# EAGLE schematic reaction_wheel_board_2017_12_11 (EAGLE 8.5.0)
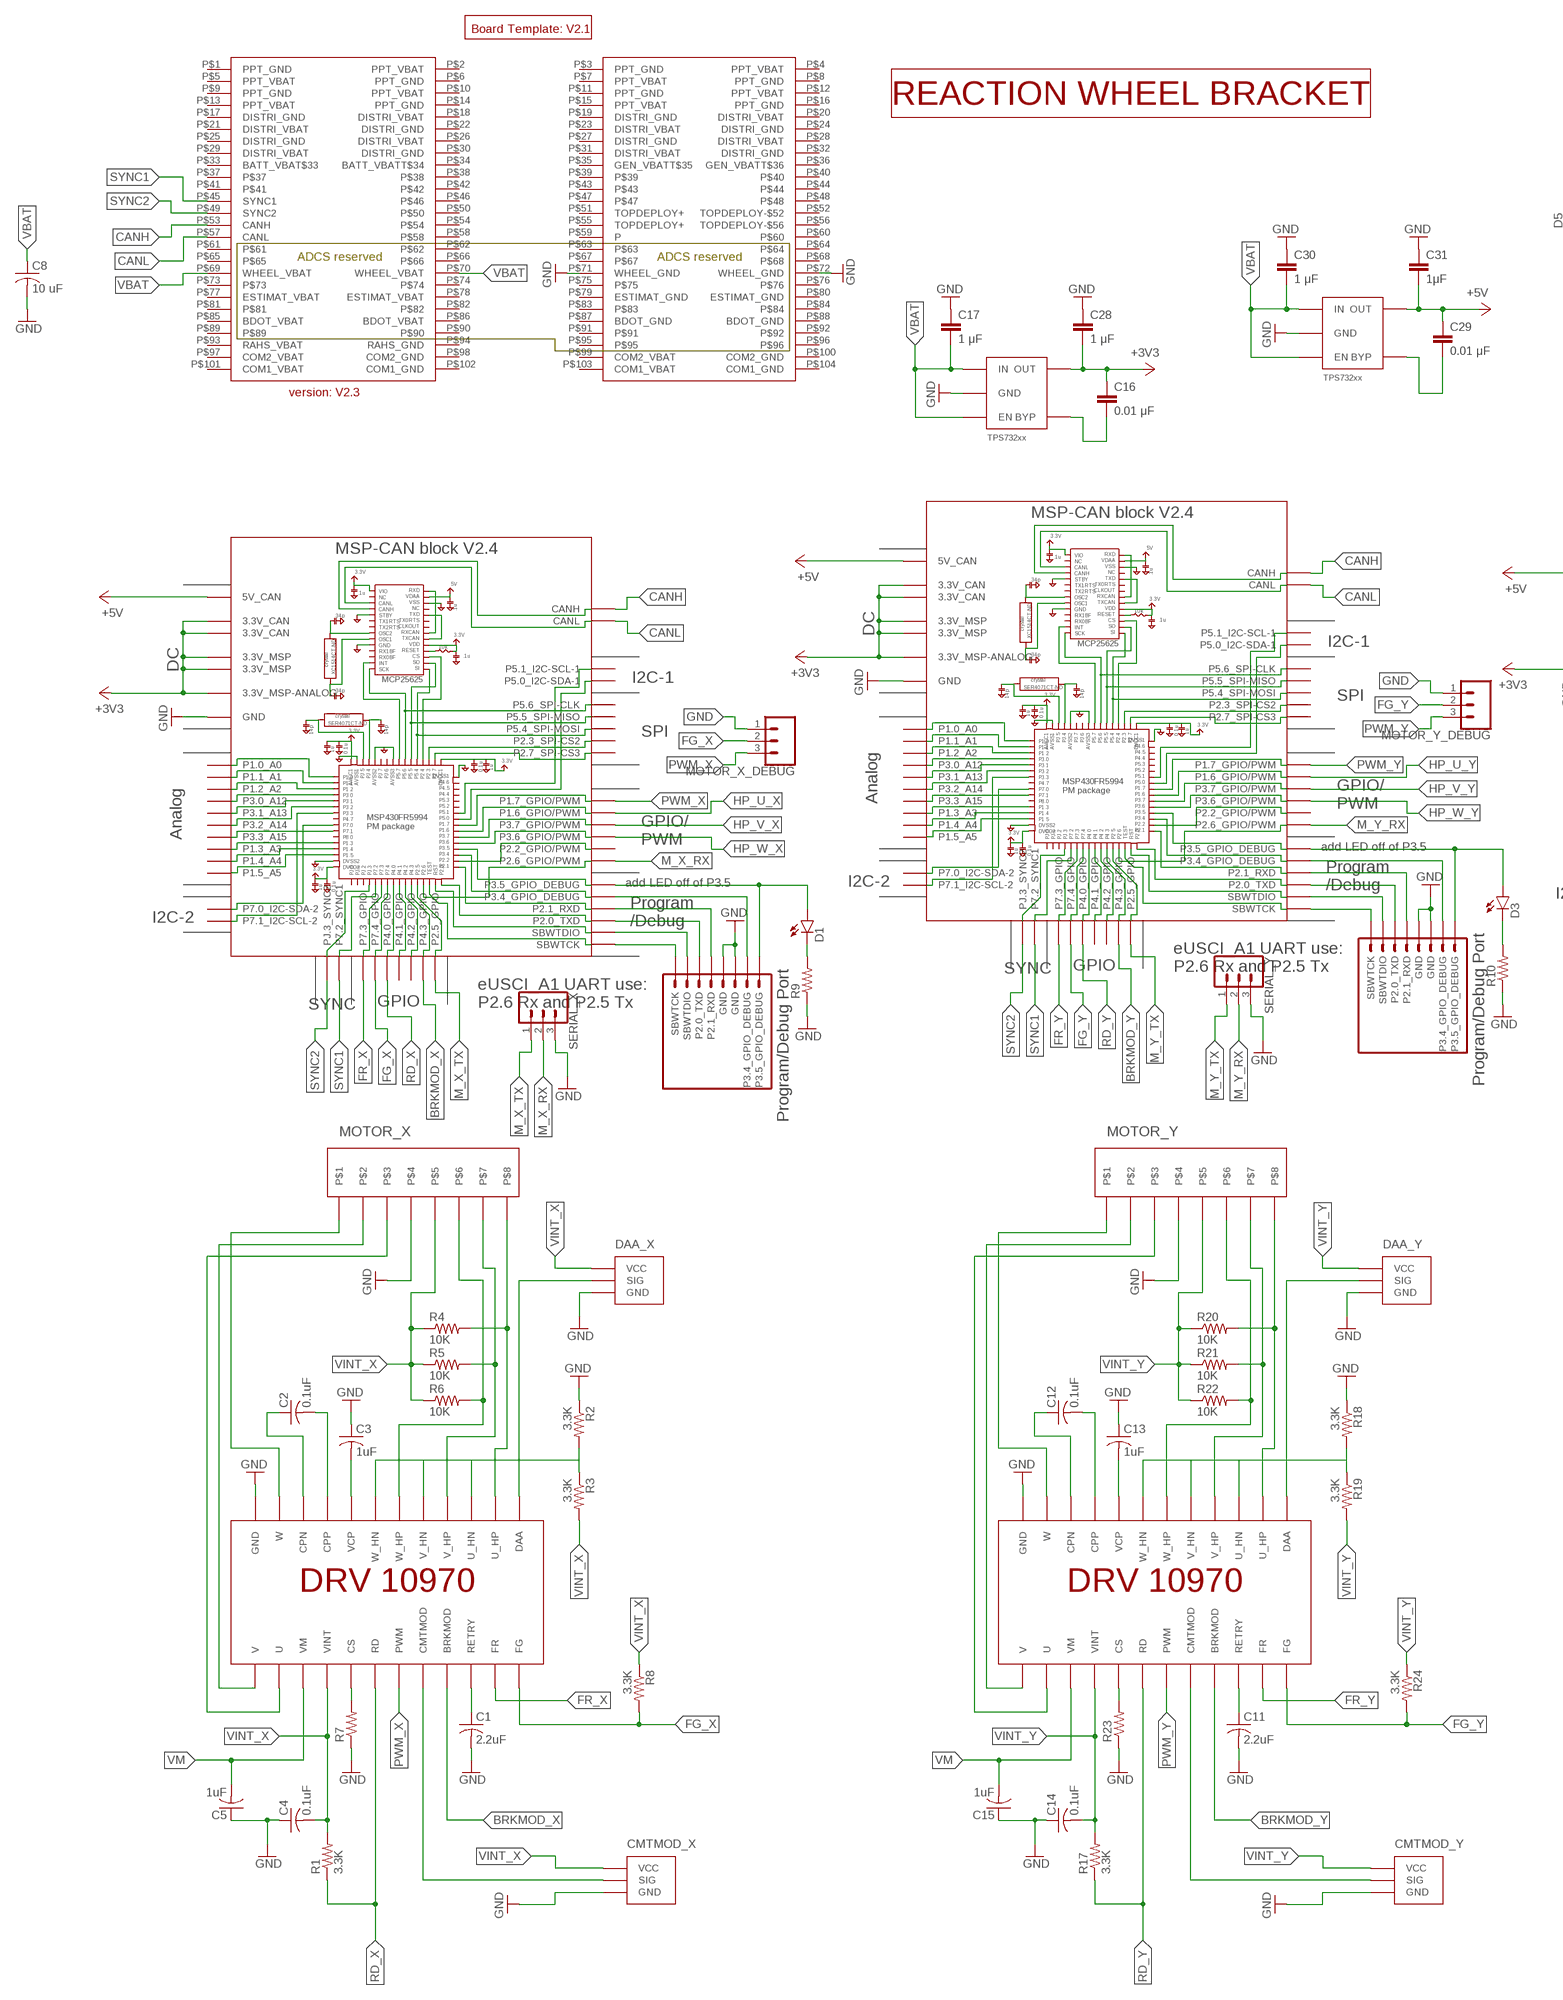
[diagram p0: schematic, sheet 1, part 1 of 2]
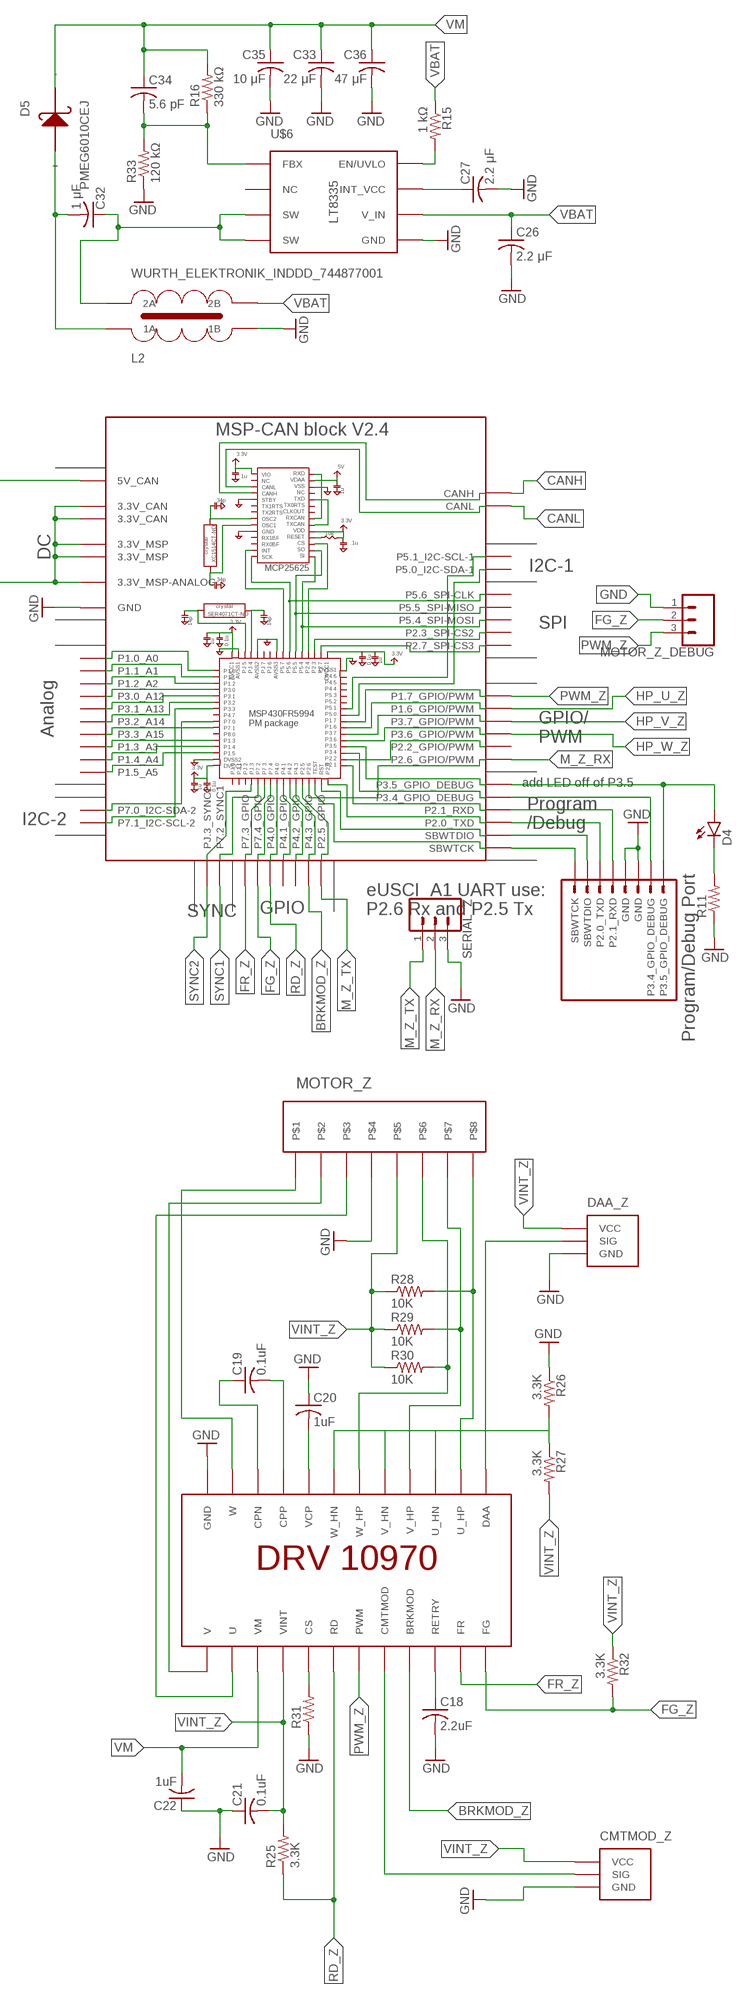
[diagram p1: schematic, sheet 1, part 2 of 2]

## Parts
C1  2.2uF  C-USC1206  [C1206]
C2  0.1uF  C-USC0805  [C0805]
C3  1uF  C-USC1206  [C1206]
C4  0.1uF  C-USC0805  [C0805]
C5  1uF  C-USC1206  [C1206]
C8  10 uF  C-USC0805  [C0805]
C11  2.2uF  C-USC1206  [C1206]
C12  0.1uF  C-USC0805  [C0805]
C13  1uF  C-USC1206  [C1206]
C14  0.1uF  C-USC0805  [C0805]
C15  1uF  C-USC1206  [C1206]
C16  0.01 μF  CAPACITOR0805  [0805]
C17  1 μF  CAPACITOR0805  [0805]
C18  2.2uF  C-USC1206  [C1206]
C19  0.1uF  C-USC0805  [C0805]
C20  1uF  C-USC1206  [C1206]
C21  0.1uF  C-USC0805  [C0805]
C22  1uF  C-USC1206  [C1206]
C26  2.2 μF  C-USC0805  [C0805]
C27  2.2 μF  C-USC0805  [C0805]
C28  1 μF  CAPACITOR0805  [0805]
C29  0.01 μF  CAPACITOR0805  [0805]
C30  1 μF  CAPACITOR0805  [0805]
C31  1μF  CAPACITOR0805  [0805]
C32  1 μF  C-USC0805  [C0805]
C33  22 μF  C-USC1206  [C1206]
C34  5.6 pF  C-USC0805  [C0805]
C35  10 μF  C-USC0805  [C0805]
C36  47 μF  C-USC1206  [C1206]
CMTMOD_X  0_OHM_JUMPER  [0_OHM_JUMPER]
CMTMOD_Y  0_OHM_JUMPER  [0_OHM_JUMPER]
CMTMOD_Z  0_OHM_JUMPER  [0_OHM_JUMPER]
D1  LED  [LED-1206]
D3  LED  [LED-1206]
D4  LED  [LED-1206]
D5  PMEG6010CEJ  [SC-90]
DAA_X  0_OHM_JUMPER  [0_OHM_JUMPER]
DAA_Y  0_OHM_JUMPER  [0_OHM_JUMPER]
DAA_Z  0_OHM_JUMPER  [0_OHM_JUMPER]
L2  WURTH_ELEKTRONIK_INDDD_744877001  [WURTH_ELEKTRONIK_INDDD_744877001]
MOTOR_X  PICOLOCK_8  [PICOLOCK_8]
MOTOR_X_DEBUG  CONN_03LOCK  [1X03_LOCK]
MOTOR_Y  PICOLOCK_8  [PICOLOCK_8]
MOTOR_Y_DEBUG  CONN_03LOCK  [1X03_LOCK]
MOTOR_Z  PICOLOCK_8  [PICOLOCK_8]
MOTOR_Z_DEBUG  CONN_03LOCK  [1X03_LOCK]
MSP_X_DEBUG  PROGRAM/DEBUG_PORT  [1X08_CONNECTOR]
MSP_Y_DEBUG  PROGRAM/DEBUG_PORT  [1X08_CONNECTOR]
MSP_Z_DEBUG  PROGRAM/DEBUG_PORT  [1X08_CONNECTOR]
PC104  PC104_CONNECTOR  [PC104_CONNECTOR]
R1  3.3K  RESISTOR0805  [0805]
R2  3.3K  RESISTOR0805  [0805]
R3  3.3K  RESISTOR0805  [0805]
R4  10K  RESISTOR0805  [0805]
R5  10K  RESISTOR0805  [0805]
R6  10K  RESISTOR0805  [0805]
R7  RESISTOR0805  [0805]
R8  3.3K  RESISTOR0805  [0805]
R9  RESISTOR0805  [0805]
R10  RESISTOR0805  [0805]
R11  RESISTOR0805  [0805]
R15  1 kΩ  RESISTOR0805  [0805]
R16  330 kΩ  RESISTOR0805  [0805]
R17  3.3K  RESISTOR0805  [0805]
R18  3.3K  RESISTOR0805  [0805]
R19  3.3K  RESISTOR0805  [0805]
R20  10K  RESISTOR0805  [0805]
R21  10K  RESISTOR0805  [0805]
R22  10K  RESISTOR0805  [0805]
R23  RESISTOR0805  [0805]
R24  3.3K  RESISTOR0805  [0805]
R25  3.3K  RESISTOR0805  [0805]
R26  3.3K  RESISTOR0805  [0805]
R27  3.3K  RESISTOR0805  [0805]
R28  10K  RESISTOR0805  [0805]
R29  10K  RESISTOR0805  [0805]
R30  10K  RESISTOR0805  [0805]
R31  RESISTOR0805  [0805]
R32  3.3K  RESISTOR0805  [0805]
R33  120 kΩ  RESISTOR0805  [0805]
SERIAL_X  CONN_03LOCK  [1X03_LOCK]
SERIAL_Y  CONN_03LOCK  [1X03_LOCK]
SERIAL_Z  CONN_03LOCK  [1X03_LOCK]
U2  TPS732XX  [SOT-23-5]
U3  TPS732XX  [SOT-23-5]
U$1  BOARD_TEMPLATESERCURED  [BOARD_TEMPLATE_SECURED]
U$3  MSP-CAN_BLOCK  [MSP-CAN_BLOCK]
U$6  LT8335  [DDB]
U$7  DRV10970  [DRV10970]
U$9  REACTION_WHEEL_BRACKET  [REACTION_WHEEL_BRACKET]
U$10  MSP-CAN_BLOCK  [MSP-CAN_BLOCK]
U$12  DRV10970  [DRV10970]
U$13  MSP-CAN_BLOCK  [MSP-CAN_BLOCK]
U$15  DRV10970  [DRV10970]

## Nets
+3V3: C16.1 C28.2 U2.P$5(OUT) U$3.3.3V@CAN1(3.3V_CAN) U$3.3.3V@CAN2(3.3V_CAN) U$3.3.3V@MSP1(3.3V_MSP) U$3.3.3V@MSP2(3.3V_MSP) U$3.3.3V_ANALOG@MSP2(3.3V_MSP-ANALOG) U$10.3.3V@CAN1(3.3V_CAN) U$10.3.3V@CAN2(3.3V_CAN) U$10.3.3V@MSP1(3.3V_MSP) U$10.3.3V@MSP2(3.3V_MSP) U$10.3.3V_ANALOG@MSP2(3.3V_MSP-ANALOG) U$13.3.3V@CAN1(3.3V_CAN) U$13.3.3V@CAN2(3.3V_CAN) U$13.3.3V@MSP1(3.3V_MSP) U$13.3.3V@MSP2(3.3V_MSP) U$13.3.3V_ANALOG@MSP2(3.3V_MSP-ANALOG)
+5V: C29.1 C31.2 U3.P$5(OUT) U$3.5V(5V_CAN) U$10.5V(5V_CAN) U$13.5V(5V_CAN)
BRKMOD_X: U$3.P4.3_GPIO U$7.BRKMOD
BRKMOD_Y: U$10.P4.3_GPIO U$12.BRKMOD
BRKMOD_Z: U$13.P4.3_GPIO U$15.BRKMOD
CANH: PC104.P$53(CANH) U$3.CANH U$10.CANH U$13.CANH
CANL: PC104.P$57(CANL) U$3.CANL U$10.CANL U$13.CANL
CMTMOD_X: CMTMOD_X.P$2(SIG) U$7.CMTMOD
CMTMOD_Y: CMTMOD_Y.P$2(SIG) U$12.CMTMOD
CMTMOD_Z: CMTMOD_Z.P$2(SIG) U$15.CMTMOD
CPN_X: C2.1 U$7.CPN
CPN_Y: C12.1 U$12.CPN
CPN_Z: C19.1 U$15.CPN
CPP_X: C2.2 U$7.CPP
CPP_Y: C12.2 U$12.CPP
CPP_Z: C19.2 U$15.CPP
CS_X: R7.2 U$7.CS
CS_Y: R23.2 U$12.CS
CS_Z: R31.2 U$15.CS
DAA_X: DAA_X.P$2(SIG) U$7.DAA
DAA_Y: DAA_Y.P$2(SIG) U$12.DAA
DAA_Z: DAA_Z.P$2(SIG) U$15.DAA
EN_UVLO: R15.2 U$6.P$8(EN/UVLO)
FBX: C34.2 R16.1 R33.2 U$6.P$1(FBX)
FG_X: MOTOR_X_DEBUG.2 R8.2 U$3.P7.4_GPIO U$7.FG
FG_Y: MOTOR_Y_DEBUG.2 R24.2 U$10.P7.4_GPIO U$12.FG
FG_Z: MOTOR_Z_DEBUG.2 R32.2 U$13.P7.4_GPIO U$15.FG
FR_X: U$3.P7.3_GPIO U$7.FR
FR_Y: U$10.P7.3_GPIO U$12.FR
FR_Z: U$13.P7.3_GPIO U$15.FR
GND: C1.2 C3.1 C4.1 C5.1 C8.2 C11.2 C13.1 C14.1 C15.1 C17.1 C18.2 C20.1 C21.1 C22.1 C26.2 C27.2 C28.1 C30.1 C31.1 C33.2 C35.2 C36.2 CMTMOD_X.P$1(GND) CMTMOD_Y.P$1(GND) CMTMOD_Z.P$1(GND) DAA_X.P$1(GND) DAA_Y.P$1(GND) DAA_Z.P$1(GND) L2.P$2(1B) MOTOR_X.P$4 MOTOR_X_DEBUG.1 MOTOR_Y.P$4 MOTOR_Y_DEBUG.1 MOTOR_Z.P$4 MOTOR_Z_DEBUG.1 MSP_X_DEBUG.5(GND) MSP_X_DEBUG.6(GND) MSP_Y_DEBUG.5(GND) MSP_Y_DEBUG.6(GND) MSP_Z_DEBUG.5(GND) MSP_Z_DEBUG.6(GND) PC104.P$71(WHEEL_GND) PC104.P$72(WHEEL_GND) R2.1 R7.1 R9.1 R10.1 R11.1 R18.1 R23.1 R26.1 R31.1 R33.1 SERIAL_X.3 SERIAL_Y.3 SERIAL_Z.3 U2.P$2(GND) U3.P$2(GND) U$3.GND@1(GND) U$3.GND@2(GND) U$3.GND@3(GND) U$3.GND@4(GND) U$3.GND@5(GND) U$3.GND@7(GND) U$3.GND@8(GND) U$3.GND@9(GND) U$3.GND@10(GND) U$3.GND@11(GND) U$3.GND@12(GND) U$3.GND@13(GND) U$3.GND@14(GND) U$3.GND@15(GND) U$3.GND@16(GND) U$3.GND@17(GND) U$3.GND@26(GND) U$6.GND U$6.P$5(GND) U$7.GND@1(GND) U$7.GND@2(GND) U$10.GND@1(GND) U$10.GND@2(GND) U$10.GND@3(GND) U$10.GND@4(GND) U$10.GND@5(GND) U$10.GND@7(GND) U$10.GND@8(GND) U$10.GND@9(GND) U$10.GND@10(GND) U$10.GND@11(GND) U$10.GND@12(GND) U$10.GND@13(GND) U$10.GND@14(GND) U$10.GND@15(GND) U$10.GND@16(GND) U$10.GND@17(GND) U$10.GND@26(GND) U$12.GND@1(GND) U$12.GND@2(GND) U$13.GND@1(GND) U$13.GND@2(GND) U$13.GND@3(GND) U$13.GND@4(GND) U$13.GND@5(GND) U$13.GND@7(GND) U$13.GND@8(GND) U$13.GND@9(GND) U$13.GND@10(GND) U$13.GND@11(GND) U$13.GND@12(GND) U$13.GND@13(GND) U$13.GND@14(GND) U$13.GND@15(GND) U$13.GND@16(GND) U$13.GND@17(GND) U$13.GND@26(GND) U$15.GND@1(GND) U$15.GND@2(GND)
GPIO_DEBUG_3.4_X: MSP_X_DEBUG.7(P3.4_GPIO_DEBUG) U$3.P3.4_GPIO_DEBUG
GPIO_DEBUG_3.4_Y: MSP_Y_DEBUG.7(P3.4_GPIO_DEBUG) U$10.P3.4_GPIO_DEBUG
GPIO_DEBUG_3.4_Z: MSP_Z_DEBUG.7(P3.4_GPIO_DEBUG) U$13.P3.4_GPIO_DEBUG
GPIO_DEBUG_3.5_X: D1.A MSP_X_DEBUG.8(P3.5_GPIO_DEBUG) U$3.P3.5_GPIO_DEBUG
GPIO_DEBUG_3.5_Y: D3.A MSP_Y_DEBUG.8(P3.5_GPIO_DEBUG) U$10.P3.5_GPIO_DEBUG
GPIO_DEBUG_3.5_Z: D4.A MSP_Z_DEBUG.8(P3.5_GPIO_DEBUG) U$13.P3.5_GPIO_DEBUG
HN_X: R2.2 R3.1 U$7.U_HN U$7.V_HN U$7.W_HN
HN_Y: R18.2 R19.1 U$12.U_HN U$12.V_HN U$12.W_HN
HN_Z: R26.2 R27.1 U$15.U_HN U$15.V_HN U$15.W_HN
HP_U_X: MOTOR_X.P$8 R4.2 U$3.P1.6_GPIO/PWM U$7.U_HP
HP_U_Y: MOTOR_Y.P$8 R20.2 U$10.P1.6_GPIO/PWM U$12.U_HP
HP_U_Z: MOTOR_Z.P$8 R28.2 U$13.P1.6_GPIO/PWM U$15.U_HP
HP_V_X: MOTOR_X.P$7 R5.2 U$3.P3.7_GPIO/PWM U$7.V_HP
HP_V_Y: MOTOR_Y.P$7 R21.2 U$10.P3.7_GPIO/PWM U$12.V_HP
HP_V_Z: MOTOR_Z.P$7 R29.2 U$13.P3.7_GPIO/PWM U$15.V_HP
HP_W_X: MOTOR_X.P$6 R6.2 U$3.P3.6_GPIO/PWM U$7.W_HP
HP_W_Y: MOTOR_Y.P$6 R22.2 U$10.P3.6_GPIO/PWM U$12.W_HP
HP_W_Z: MOTOR_Z.P$6 R30.2 U$13.P3.6_GPIO/PWM U$15.W_HP
INT_VCC: C27.1 U$6.P$7(INT_VCC)
LDO_3V3_BYP2: C16.2 U2.P$4(BYP)
LDO_5V_BYP: C29.2 U3.P$4(BYP)
M_X_RX: SERIAL_X.2 U$3.P2.6_GPIO/PWM
M_X_TX: SERIAL_X.1 U$3.P2.5_GPIO
M_Y_RX: SERIAL_Y.2 U$10.P2.6_GPIO/PWM
M_Y_TX: SERIAL_Y.1 U$10.P2.5_GPIO
M_Z_RX: SERIAL_Z.2 U$13.P2.6_GPIO/PWM
M_Z_TX: SERIAL_Z.1 U$13.P2.5_GPIO
N$2: D4.C R11.2
N$3: D3.C R10.2
N$4: D1.C R9.2
PWM_X: MOTOR_X_DEBUG.3 U$3.P1.7_GPIO/PWM U$7.PWM
PWM_Y: MOTOR_Y_DEBUG.3 U$10.P1.7_GPIO/PWM U$12.PWM
PWM_Z: MOTOR_Z_DEBUG.3 U$13.P1.7_GPIO/PWM U$15.PWM
RD_X: R1.1 U$3.P4.0_GPIO U$7.RD
RD_Y: R17.1 U$10.P4.0_GPIO U$12.RD
RD_Z: R25.1 U$13.P4.0_GPIO U$15.RD
RETRY_X: C1.1 U$7.RETRY
RETRY_Y: C11.1 U$12.RETRY
RETRY_Z: C18.1 U$15.RETRY
RXD_X: MSP_X_DEBUG.4(P2.1_RXD) U$3.P2.1_RXD
RXD_Y: MSP_Y_DEBUG.4(P2.1_RXD) U$10.P2.1_RXD
RXD_Z: MSP_Z_DEBUG.4(P2.1_RXD) U$13.P2.1_RXD
SBWTCK_X: MSP_X_DEBUG.SBWTCK U$3.SBWTCK
SBWTCK_Y: MSP_Y_DEBUG.SBWTCK U$10.SBWTCK
SBWTCK_Z: MSP_Z_DEBUG.SBWTCK U$13.SBWTCK
SBWTDIO_X: MSP_X_DEBUG.2(SBWTDIO) U$3.SBWTDIO
SBWTDIO_Y: MSP_Y_DEBUG.2(SBWTDIO) U$10.SBWTDIO
SBWTDIO_Z: MSP_Z_DEBUG.2(SBWTDIO) U$13.SBWTDIO
SW: C32.1 L2.P$3(2A) U$6.P$3(SW) U$6.P$4(SW)
SYNC1: PC104.P$45(SYNC1) U$3.P7.2_SYNC1 U$10.P7.2_SYNC1 U$13.P7.2_SYNC1
SYNC2: PC104.P$49(SYNC2) U$3.PJ.3_SYNC2 U$10.PJ.3_SYNC2 U$13.PJ.3_SYNC2
TXD_X: MSP_X_DEBUG.3(P2.0_TXD) U$3.P2.0_TXD
TXD_Y: MSP_Y_DEBUG.3(P2.0_TXD) U$10.P2.0_TXD
TXD_Z: MSP_Z_DEBUG.3(P2.0_TXD) U$13.P2.0_TXD
U_X: MOTOR_X.P$3 U$7.U
U_Y: MOTOR_Y.P$3 U$12.U
U_Z: MOTOR_Z.P$3 U$15.U
V_X: MOTOR_X.P$2 U$7.V
V_Y: MOTOR_Y.P$2 U$12.V
V_Z: MOTOR_Z.P$2 U$15.V
VBAT: C8.1 C17.2 C26.1 C30.2 L2.P$4(2B) PC104.P$69(WHEEL_VBAT) PC104.P$70(WHEEL_VBAT) R15.1 U2.P$1(IN) U2.P$3(EN) U3.P$1(IN) U3.P$3(EN) U$6.P$6(V_IN)
VCP_X: C3.2 U$7.VCP
VCP_Y: C13.2 U$12.VCP
VCP_Z: C20.2 U$15.VCP
VD: C32.2 D5.P$1(+) L2.P$1(1A)
VINT_X: C4.2 CMTMOD_X.P$3(VCC) DAA_X.P$3(VCC) MOTOR_X.P$5 R1.2 R3.2 R4.1 R5.1 R6.1 R8.1 U$7.VINT
VINT_Y: C14.2 CMTMOD_Y.P$3(VCC) DAA_Y.P$3(VCC) MOTOR_Y.P$5 R17.2 R19.2 R20.1 R21.1 R22.1 R24.1 U$12.VINT
VINT_Z: C21.2 CMTMOD_Z.P$3(VCC) DAA_Z.P$3(VCC) MOTOR_Z.P$5 R25.2 R27.2 R28.1 R29.1 R30.1 R32.1 U$15.VINT
VM: C5.2 C15.2 C22.2 C33.1 C34.1 C35.1 C36.1 D5.P$2(-) R16.2 U$7.VM U$12.VM U$15.VM
W_X: MOTOR_X.P$1 U$7.W
W_Y: MOTOR_Y.P$1 U$12.W
W_Z: MOTOR_Z.P$1 U$15.W
Unconnected: PC104.P$1(PPT_GND) PC104.P$2(PPT_VBAT) PC104.P$3(PPT_GND) PC104.P$4(PPT_VBAT) PC104.P$5(PPT_VBAT) PC104.P$6(PPT_GND) PC104.P$7(PPT_VBAT) PC104.P$8(PPT_GND) PC104.P$9(PPT_GND) PC104.P$10(PPT_VBAT) PC104.P$11(PPT_GND) PC104.P$12(PPT_VBAT) PC104.P$13(PPT_VBAT) PC104.P$14(PPT_GND) PC104.P$15(PPT_VBAT) PC104.P$16(PPT_GND) PC104.P$17(DISTRI_GND) PC104.P$18(DISTRI_VBAT) PC104.P$19(DISTRI_GND) PC104.P$20(DISTRI_VBAT) PC104.P$21(DISTRI_VBAT) PC104.P$22(DISTRI_GND) PC104.P$23(DISTRI_VBAT) PC104.P$24(DISTRI_GND) PC104.P$25(DISTRI_GND) PC104.P$26(DISTRI_VBAT) PC104.P$27(DISTRI_GND) PC104.P$28(DISTRI_VBAT) PC104.P$29(DISTRI_VBAT) PC104.P$30(DISTRI_GND) PC104.P$31(DISTRI_VBAT) PC104.P$32(DISTRI_GND) PC104.P$33(BATT_VBAT$33) PC104.P$34(BATT_VBATT$34) PC104.P$35(GEN_VBATT$35) PC104.P$36(GEN_VBATT$36) PC104.P$37 PC104.P$38 PC104.P$39 PC104.P$40 PC104.P$41 PC104.P$42 PC104.P$43 PC104.P$44 PC104.P$46 PC104.P$47 PC104.P$48 PC104.P$50 PC104.P$51(TOPDEPLOY+) PC104.P$52(TOPDEPLOY-$52) PC104.P$54 PC104.P$55(TOPDEPLOY+) PC104.P$56(TOPDEPLOY-$56) PC104.P$58 PC104.P$59(P) PC104.P$60 PC104.P$61 PC104.P$62 PC104.P$63 PC104.P$64 PC104.P$65 PC104.P$66 PC104.P$67 PC104.P$68 PC104.P$73 PC104.P$74 PC104.P$75 PC104.P$76 PC104.P$77(ESTIMAT_VBAT) PC104.P$78(ESTIMAT_VBAT) PC104.P$79(ESTIMAT_GND) PC104.P$80(ESTIMAT_GND) PC104.P$81 PC104.P$82 PC104.P$83 PC104.P$84 PC104.P$85(BDOT_VBAT) PC104.P$86(BDOT_VBAT) PC104.P$87(BDOT_GND) PC104.P$88(BDOT_GND) PC104.P$89 PC104.P$90 PC104.P$91 PC104.P$92 PC104.P$93(RAHS_VBAT) PC104.P$94(RAHS_GND) PC104.P$95 PC104.P$96 PC104.P$97(COM2_VBAT) PC104.P$98(COM2_GND) PC104.P$99(COM2_VBAT) PC104.P$100(COM2_GND) PC104.P$101(COM1_VBAT) PC104.P$102(COM1_GND) PC104.P$103(COM1_VBAT) PC104.P$104(COM1_GND) U$3.P1.0_A0 U$3.P1.1_A1 U$3.P1.2_A2 U$3.P1.3_A3 U$3.P1.4_A4 U$3.P1.5_A5 U$3.P2.2_GPIO/PWM U$3.P2.4_SPI-CS2(P2.3_SPI-CS2) U$3.P2.7_SPI-CS3 U$3.P3.0_A12 U$3.P3.1_A13 U$3.P3.2_A14 U$3.P3.3_A15 U$3.P4.1_GPIO U$3.P4.2_GPIO U$3.P5.0_I2C-SDA-1 U$3.P5.1_I2C-SCL-1 U$3.P5.4_SPI-MOSI U$3.P5.5_SPI-MISO U$3.P5.6_SPI-CLK U$3.P7.0_I2C-SDA-2 U$3.P7.1_I2C-SCL-2 U$6.P$2(NC) U$10.P1.0_A0 U$10.P1.1_A1 U$10.P1.2_A2 U$10.P1.3_A3 U$10.P1.4_A4 U$10.P1.5_A5 U$10.P2.2_GPIO/PWM U$10.P2.4_SPI-CS2(P2.3_SPI-CS2) U$10.P2.7_SPI-CS3 U$10.P3.0_A12 U$10.P3.1_A13 U$10.P3.2_A14 U$10.P3.3_A15 U$10.P4.1_GPIO U$10.P4.2_GPIO U$10.P5.0_I2C-SDA-1 U$10.P5.1_I2C-SCL-1 U$10.P5.4_SPI-MOSI U$10.P5.5_SPI-MISO U$10.P5.6_SPI-CLK U$10.P7.0_I2C-SDA-2 U$10.P7.1_I2C-SCL-2 U$13.P1.0_A0 U$13.P1.1_A1 U$13.P1.2_A2 U$13.P1.3_A3 U$13.P1.4_A4 U$13.P1.5_A5 U$13.P2.2_GPIO/PWM U$13.P2.4_SPI-CS2(P2.3_SPI-CS2) U$13.P2.7_SPI-CS3 U$13.P3.0_A12 U$13.P3.1_A13 U$13.P3.2_A14 U$13.P3.3_A15 U$13.P4.1_GPIO U$13.P4.2_GPIO U$13.P5.0_I2C-SDA-1 U$13.P5.1_I2C-SCL-1 U$13.P5.4_SPI-MOSI U$13.P5.5_SPI-MISO U$13.P5.6_SPI-CLK U$13.P7.0_I2C-SDA-2 U$13.P7.1_I2C-SCL-2

## Library data of the parts
C1-C5 C8 C11-C15 C18-C22 C26 C27 C32-C36 = rcl:C-US: CAPACITOR, American symbol; SPICEPREFIX: C
C16 C17 C28-C31 = DubSat1 Components:CAPACITOR: Capacitor Standard 0603 ceramic capacitor, and 0.1" leaded capacitor.
CMTMOD_X CMTMOD_Y CMTMOD_Z DAA_X DAA_Y DAA_Z = DubSat1 Components:0_OHM_JUMPER
D1 D3 D4 = DubSat1 Components:LED
D5 = DubSat1 Components:PMEG6010CEJ
L2 = DubSat1 Components:WURTH_ELEKTRONIK_INDDD_744877001
MOTOR_X MOTOR_Y MOTOR_Z = DubSat1 Components:PICOLOCK_8
MOTOR_X_DEBUG MOTOR_Y_DEBUG MOTOR_Z_DEBUG SERIAL_X SERIAL_Y SERIAL_Z = SparkFun-Connectors:CONN_03: Multi connection point. Often used as Generic Header-pin footprint for 0.1 inch spaced/style header connections On any of the 0.1 inch spaced packages, you can populate with these: Break Away Headers - Straight <https://www.sparkfun.com/products/116> (PRT-00116) Break Away Male Headers - Right Angle <https://www.sparkfun.com/products/553> (PRT-00553) Female Headers <https://www.sparkfun.com/products/115> (PRT-00115) Break Away Headers - Machine Pin <https://www.sparkfun.com/products/117> (PRT-00117) Break Away Female Headers - Swiss Machine Pin <https://www.sparkfun.com/products/743> (PRT-00743) Stackable Header - 3 Pin (Female, 0.1") <https://www.sparkfun.com/products/13875> (PRT-13875) For SCREWTERMINALS and SPRING TERMINALS visit here: Screw Terimnals on SparkFun.com <https://www.sparkfun.com/search/results?term=Screw+Terminals> (5mm/3.5mm/2.54mm spacing) This device is also useful as a general connection point to wire up your design to another part of your project. Our various solder wires solder well into these plated through hole pads. Hook-Up Wire - Assortment (Stranded, 22 AWG) <https://www.sparkfun.com/products/11375> (PRT-11375) Hook-Up Wire - Assortment (Solid Core, 22 AWG) <https://www.sparkfun.com/products/11367> (PRT-11367) View the entire wire category on our website here <https://www.sparkfun.com/categories/141> Special notes: Molex polarized connector foot print use with SKU : PRT-08232 with associated crimp pins and housings.
MSP_X_DEBUG MSP_Y_DEBUG MSP_Z_DEBUG = DubSat1 Components:PROGRAM/DEBUG_PORT
PC104 = DubSat1 Components:PC104_CONNECTOR
R1-R11 R15-R33 = DubSat1 Components:RESISTOR: Resistor Basic schematic elements and footprints for 0603, 1206, and PTH resistors.
U2 U3 = DubSat1 Components:TPS732XX
U$1 = DubSat1 Components:BOARD_TEMPLATE
U$3 U$10 U$13 = DubSat1 Components:MSP-CAN_BLOCK
U$6 = DubSat1 Components:LT8335
U$7 U$12 U$15 = DubSat1 Components:DRV10970
U$9 = DubSat1 Components:REACTION_WHEEL_BRACKET

## Net classes
0 default: width 0.254 mm, drill 0.254 mm, clearance 0.152 mm